# Altium schematic sheet 搅拌驱动驱动.SchDoc
size A4
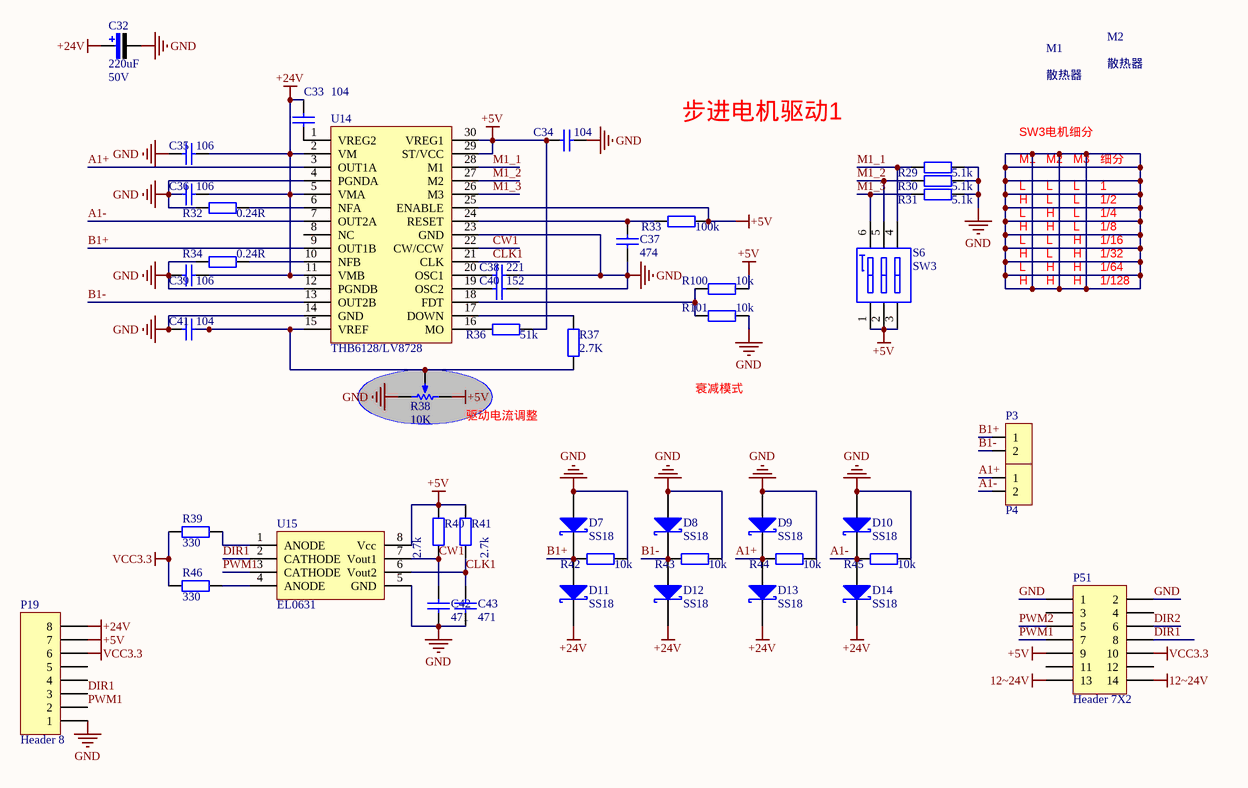
[diagram p0: 搅拌驱动驱动.SchDoc]

## Parts
C32  value 220uF  Vol: 50V  [C-RB-S10]  (hidden comment: Cap Pol)
C33  value 104  [C-RAD-0603]  (hidden comment: Cap)
C34  value 104  [C-RAD-0603]  (hidden comment: Cap)
C35  value 106  [C-RAD-0603]  (hidden comment: Cap)
C36  value 106  [C-RAD-0603]  (hidden comment: Cap)
C37  value 474  [C-RAD-0603]  (hidden comment: Cap)
C38  value 221  [C-RAD-0603]  (hidden comment: Cap)
C39  value 106  [C-RAD-0603]  (hidden comment: Cap)
C40  value 152  [C-RAD-0603]  (hidden comment: Cap)
C41  value 104  [C-RAD-0603]  (hidden comment: Cap)
C42  value 471  [C-RAD-0603]  (hidden comment: Cap)
C43  value 471  [C-RAD-0603]  (hidden comment: Cap)
D7  Type: SS18  [DIODE-SMA]  (hidden comment: D-Schottky)
D8  Type: SS18  [DIODE-SMA]  (hidden comment: D-Schottky)
D9  Type: SS18  [DIODE-SMA]  (hidden comment: D-Schottky)
D10  Type: SS18  [DIODE-SMA]  (hidden comment: D-Schottky)
D11  Type: SS18  [DIODE-SMA]  (hidden comment: D-Schottky)
D12  Type: SS18  [DIODE-SMA]  (hidden comment: D-Schottky)
D13  Type: SS18  [DIODE-SMA]  (hidden comment: D-Schottky)
D14  Type: SS18  [DIODE-SMA]  (hidden comment: D-Schottky)
M1  散热器  [26*26*10对角37.5]
M2  散热器  [26*26*10对角37.5]
P3  cnt2p  [接线端子5mm间距2p]  (value not drawn)
P4  cnt2p  [接线端子5mm间距2p]  (value not drawn)
P19  Header 8  [PH2.0-8P]
P51  Header 7X2  [HDR7X2_A1]
R29  value 5.1k  [0603-1]  (hidden comment: Res1)
R30  value 5.1k  [0603-1]  (hidden comment: Res1)
R31  value 5.1k  [0603-1]  (hidden comment: Res1)
R32  value 0.24R  [2512]  (hidden comment: Res1)
R33  value 100k  [0603-1]  (hidden comment: Res1)
R34  value 0.24R  [2512]  (hidden comment: Res1)
R36  value 51k  [0603-1]  (hidden comment: Res1)
R37  value 2.7K  [0603-1]  (hidden comment: Res1)
R38  value 10K  [VR-3266W]  (hidden comment: RPot)
R39  value 330  [0603-1]  (hidden comment: Res1)
R40  value 2.7k  [0603-1]  (hidden comment: Res1)
R41  value 2.7k  [0603-1]  (hidden comment: Res1)
R42  value 10k  [0603-1]  (hidden comment: Res1)
R43  value 10k  [0603-1]  (hidden comment: Res1)
R44  value 10k  [0603-1]  (hidden comment: Res1)
R45  value 10k  [0603-1]  (hidden comment: Res1)
R46  value 330  [0603-1]  (hidden comment: Res1)
R100  value 10k  [0603-1]  (hidden comment: Res1)
R101  value 10k  [0603-1]  (hidden comment: Res1)
S6  SW3  [SW6_3BIT]
U14  THB6128/LV8728  [SIOC-30-W]
U15  EL0631  [EL0631]

## Nets
12~24V: P51.13 P51.14
+5V: C34.1 P19.7 P51.9 R33.2 R36.2 R38.1(TOP) R40.2 R41.2 R100.2 S6.1 S6.2 S6.3 U14.25(ENABLE) U14.29(ST/VCC) U14.30(VREG1) U15.8(Vcc)
+24V: C32.1 C33.1 C35.2 C36.2 C39.2 D11.2(K) D12.2(K) D13.2(K) D14.2(K) P19.8 U14.2(VM) U14.5(VMA) U14.11(VMB)
GND: C32.2 C34.2 C35.1 C36.1 C37.1 C38.2 C39.1 C40.2 C41.1 C42.1 C43.1 D7.1(A) D8.1(A) D9.1(A) D10.1(A) P19.1 P51.1 P51.2 R29.2 R30.2 R31.2 R32.1 R34.2 R38.3(BOT) R42.2 R43.2 R44.2 R45.2 R101.2 U14.4(PGNDA) U14.12(PGNDB) U14.14(GND) U14.23(GND) U15.5(GND)
VCC3.3: P19.6 P51.10 R39.2 R46.2
A1+: D9.2(K) D13.1(A) P4.1 R44.1 U14.3(OUT1A)
A1-: D10.2(K) D14.1(A) P4.2 R45.1 U14.7(OUT2A)
B1+: D7.2(K) D11.1(A) P3.1 R42.1 U14.9(OUT1B)
B1-: D8.2(K) D12.1(A) P3.2 R43.1 U14.13(OUT2B)
CLK1: C43.2 R41.1 U14.21(CLK) U15.6(Vout2)
CW1: C42.2 R40.1 U14.22(CW/CCW) U15.7(Vout1)
DIR1: P19.3 P51.8 U15.2(CATHODE)
DIR2: P51.6
M1_1: R29.1 S6.4 U14.28(M1)
M1_2: R30.1 S6.5 U14.27(M2)
M1_3: R31.1 S6.6 U14.26(M3)
PWM1: P19.2 P51.7 U15.3(CATHODE)
PWM2: P51.5
NetC33_2: C33.2 U14.1(VREG2)
NetC37_2: C37.2 R33.1 U14.24(RESET)
NetC38_1: C38.1 U14.20(OSC1)
NetC40_1: C40.1 U14.19(OSC2)
NetC41_2: C41.2 R37.2 R38.2(TAP) U14.15(VREF)
NetR32_2: R32.2 U14.6(NFA)
NetR34_1: R34.1 U14.10(NFB)
NetR36_1: R36.1 U14.16(MO)
NetR37_1: R37.1 U14.17(DOWN)
NetR39_1: R39.1 U15.1(ANODE)
NetR46_1: R46.1 U15.4(ANODE)
NetR100_1: R100.1 R101.1 U14.18(FDT)

Not connected (* = marked no-connect by the designer): P19 4 5; P51 3 4 11 12; U14 8(NC)

## Notes on the sheet
- 步进电机驱动1
- M1
- L
- SW3电机细分
- M2
- M3
- 细分
- 1
- H
- 1/2
- 1/4
- 1/8
- 1/16
- 1/32
- 1/64
- 1/128
- 衰减模式
- (near R38) 驱动电流调整

## Library data of the parts
C32 = Cap Pol: 极性电解电容; Published: 8-Jun-2000; LatestRevisionDate: 17-Jul-2002; LatestRevisionNote: Re-released for DXP Platform.; PackageReference: RB7.6-15; Publisher: Altium Limited
C33-C43 = Cap: 无极性电容; Published: 8-Jun-2000; LatestRevisionDate: 17-Jul-2002; LatestRevisionNote: Re-released for DXP Platform.; PackageReference: RAD-0.3; Publisher: Altium Limited
D7-D14 = D-Schottky: 肖特基二极管; Published: 8-Jun-2000; LatestRevisionDate: 17-Jul-2002; LatestRevisionNote: Re-released for DXP Platform.; PackageReference: SMB; Publisher: Altium Limited; Code_JEDEC: DO-214-AA
M1 M2 = 26*26*10散热器: 26*26*10MM散热器孔距37MM; 链接: https://item.taobao.com/item.htm?spm=a1z10.5-c.w4002-16073799567.19.6c7860d7hcre0b&id=550027229822
P19 = Header 8: Header, 8-Pin; LatestRevisionDate: 17-Jul-2002; LatestRevisionNote: Re-released for DXP Platform.; Publisher: Altium Limited
P51 = Header 7X2: Header, 7-Pin; LatestRevisionDate: 17-Jul-2002; LatestRevisionNote: Re-released for DXP Platform.; Publisher: Altium Limited
R29-R34 R36 R37 R39-R46 R100 R101 = Res1: 贴片电阻; Published: 8-Jun-2000; LatestRevisionDate: 17-Jul-2002; LatestRevisionNote: Re-released for DXP Platform.; PackageReference: AXIAL-0.4; Publisher: Altium Limited
R38 = RPot: 精密可调电阻; Sim Note: Enter the Resistance value and the set point into parameter fields.; Set Position: 0.5; Published: 8-Jun-2000; LatestRevisionDate: 17-Jul-2002; LatestRevisionNote: Re-released for DXP Platform.; PackageReference: VR5; Publisher: Altium Limited
S6 = SW3: 3位编码开关
U14 = THB6128: 步进电机驱动
U15 = EL0631: 双路隔离光耦